# EAGLE design 8-Bit Instruction Register Part 2 (EAGLE 7.5.0)
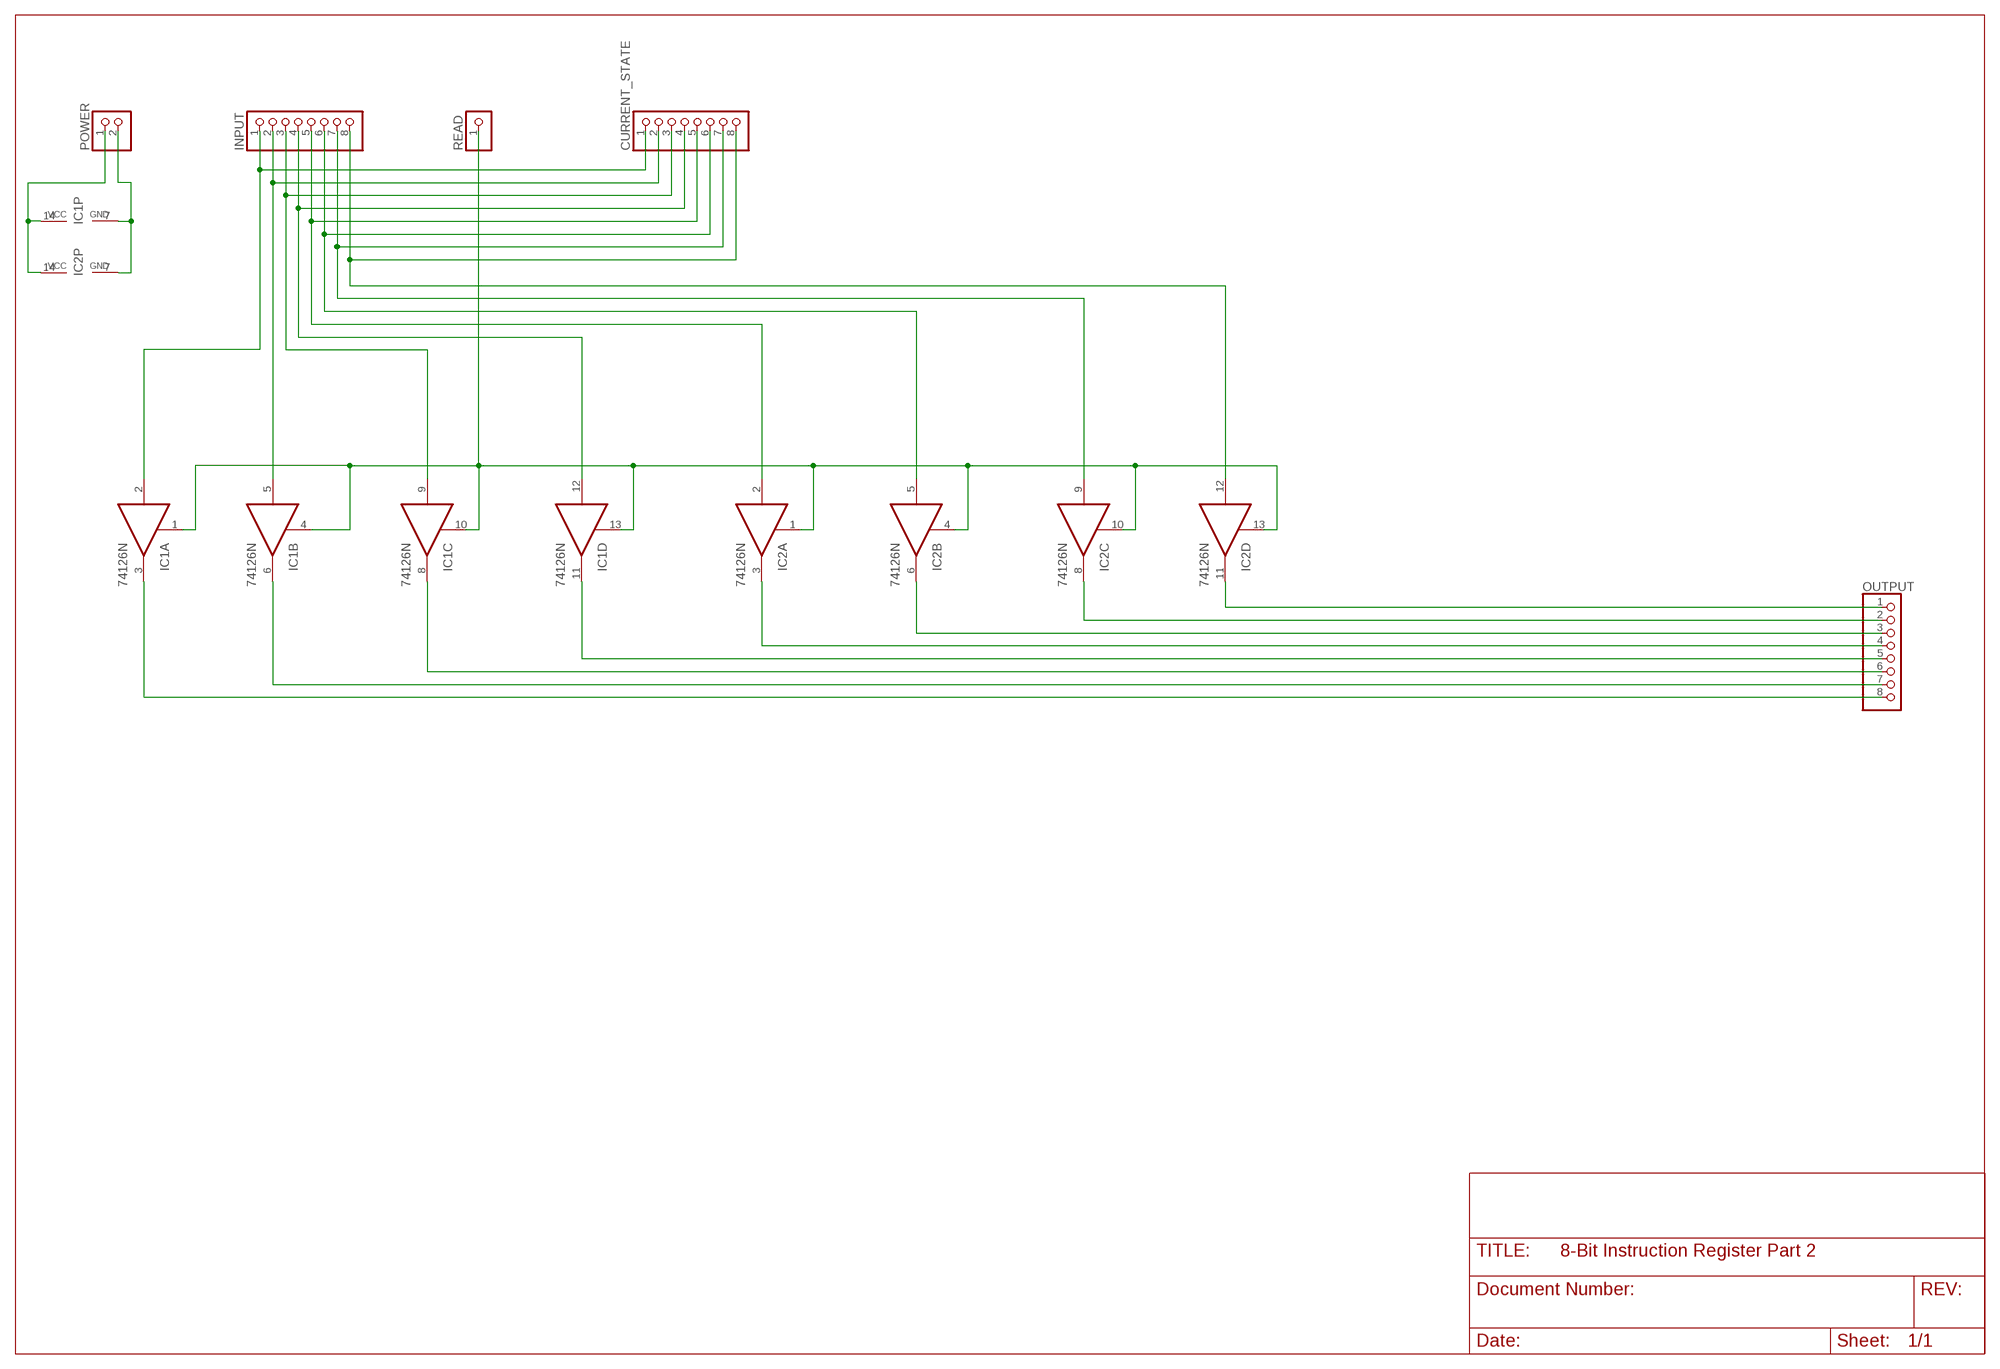
[diagram p0: schematic, sheet 1]

## Parts
CURRENT_STATE  PINHD-1X8  [1X08]
IC1  74126N  [DIL14]
IC2  74126N  [DIL14]
INPUT  PINHD-1X8  [1X08]
OUTPUT  PINHD-1X8  [1X08]
POWER  PINHD-1X2  [1X02]
READ  PINHD-1X1  [1X01]

## Nets
GND: IC1.7(P:GND) IC2.7(P:GND) POWER.2
N$1: CURRENT_STATE.1 IC1.2(A:I) INPUT.1
N$2: CURRENT_STATE.2 IC1.5(B:I) INPUT.2
N$3: CURRENT_STATE.3 IC1.9(C:I) INPUT.3
N$4: CURRENT_STATE.4 IC1.12(D:I) INPUT.4
N$5: CURRENT_STATE.5 IC2.2(A:I) INPUT.5
N$6: CURRENT_STATE.6 IC2.5(B:I) INPUT.6
N$7: CURRENT_STATE.7 IC2.9(C:I) INPUT.7
N$8: CURRENT_STATE.8 IC2.12(D:I) INPUT.8
N$10: IC1.1(A:OE) IC1.4(B:OE) IC1.10(C:OE) IC1.13(D:OE) IC2.1(A:OE) IC2.4(B:OE) IC2.10(C:OE) IC2.13(D:OE) READ.1
N$11: IC1.3(A:O) OUTPUT.8
N$12: IC1.6(B:O) OUTPUT.7
N$13: IC1.8(C:O) OUTPUT.6
N$14: IC1.11(D:O) OUTPUT.5
N$15: IC2.3(A:O) OUTPUT.4
N$16: IC2.6(B:O) OUTPUT.3
N$17: IC2.8(C:O) OUTPUT.2
N$18: IC2.11(D:O) OUTPUT.1
VCC: IC1.14(P:VCC) IC2.14(P:VCC) POWER.1

## Library data of the parts
CURRENT_STATE INPUT OUTPUT = pinhead:PINHD-1X8: PIN HEADER
IC1 IC2 = 74xx-eu:74*126: Quad bus BUFFER, 3-state
POWER = pinhead:PINHD-1X2: PIN HEADER
READ = pinhead:PINHD-1X1: PIN HEADER

## Board
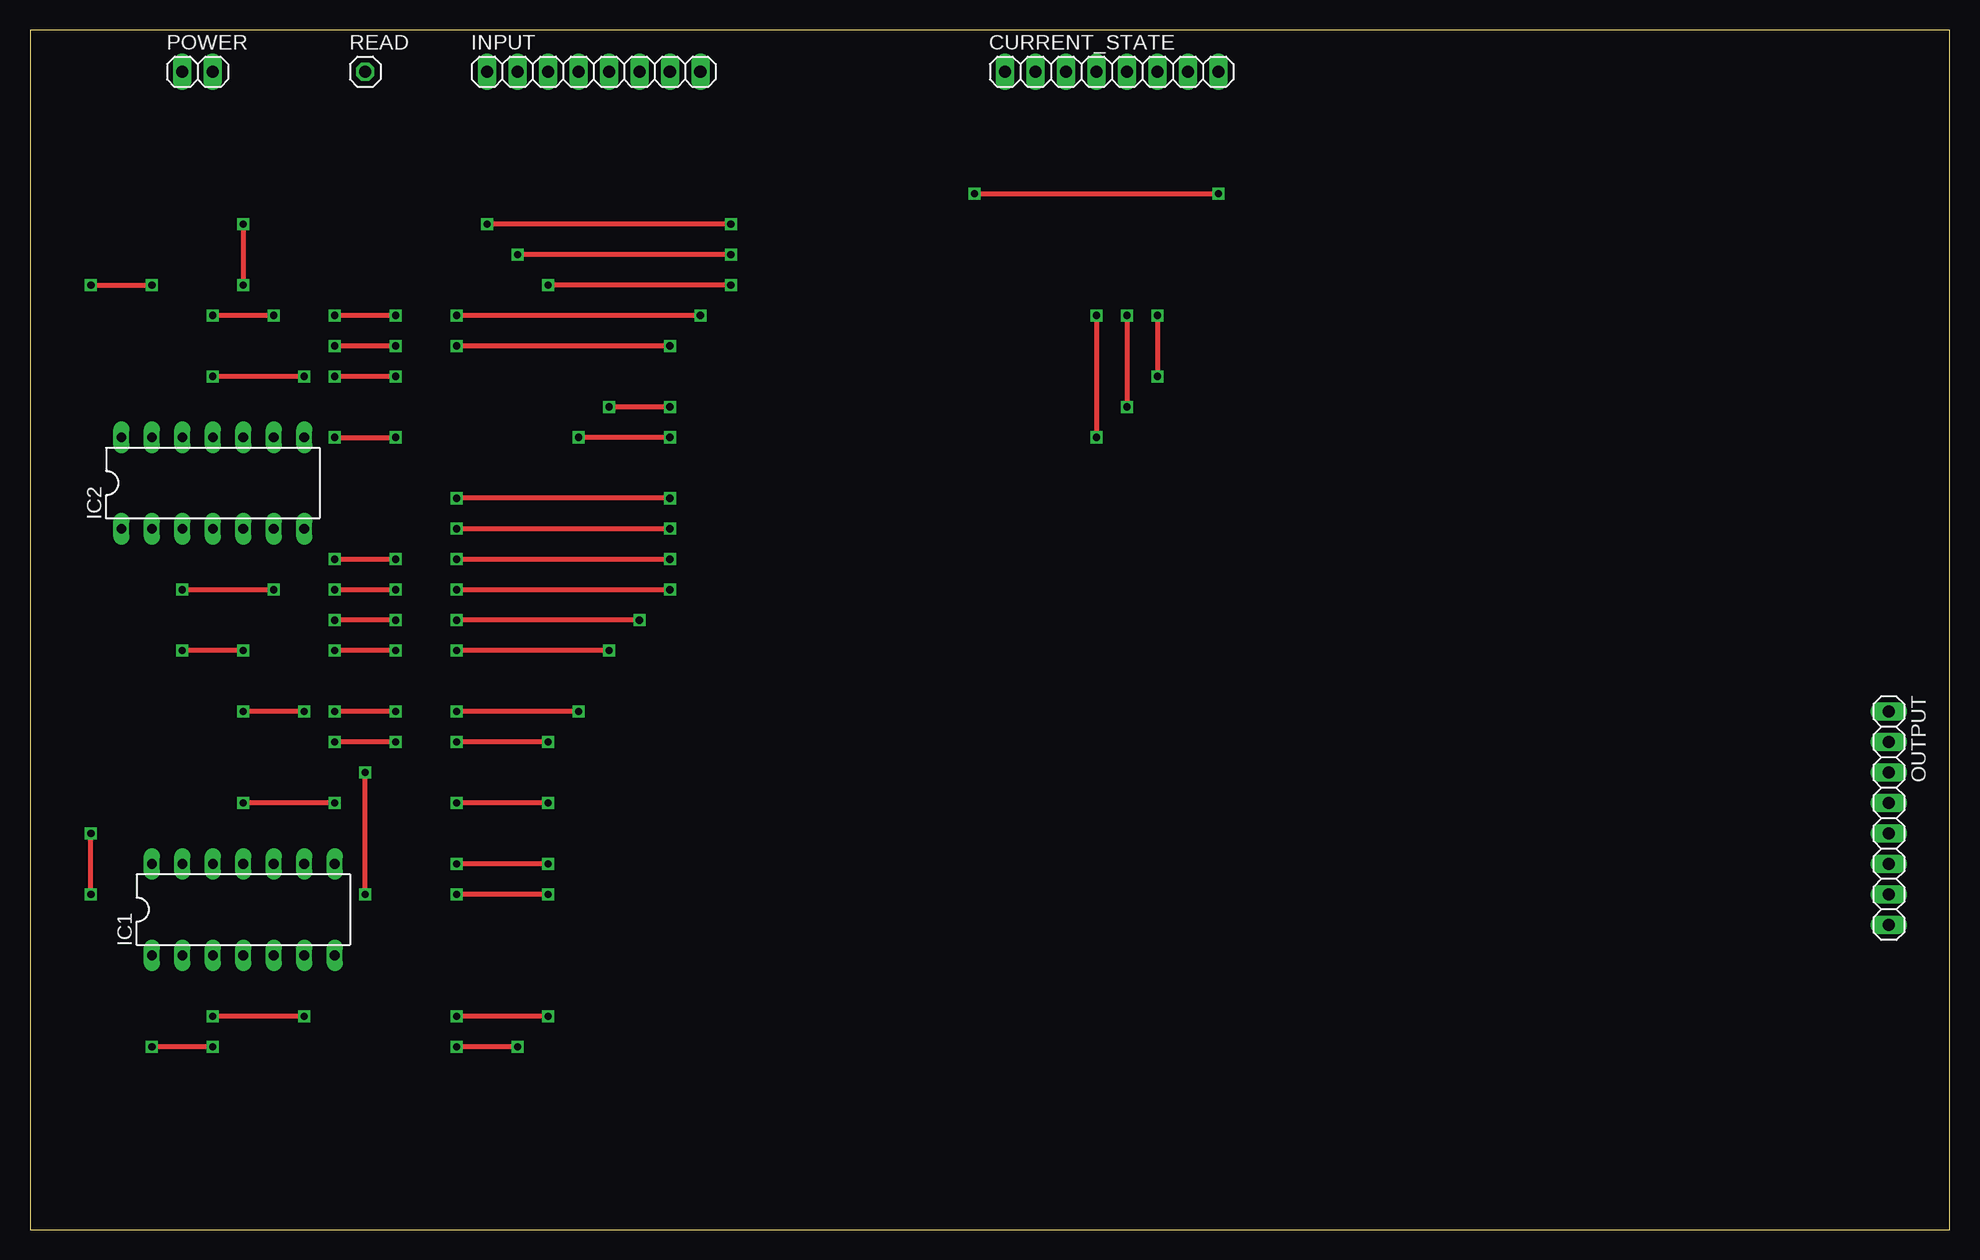
[diagram p1: board, top side]
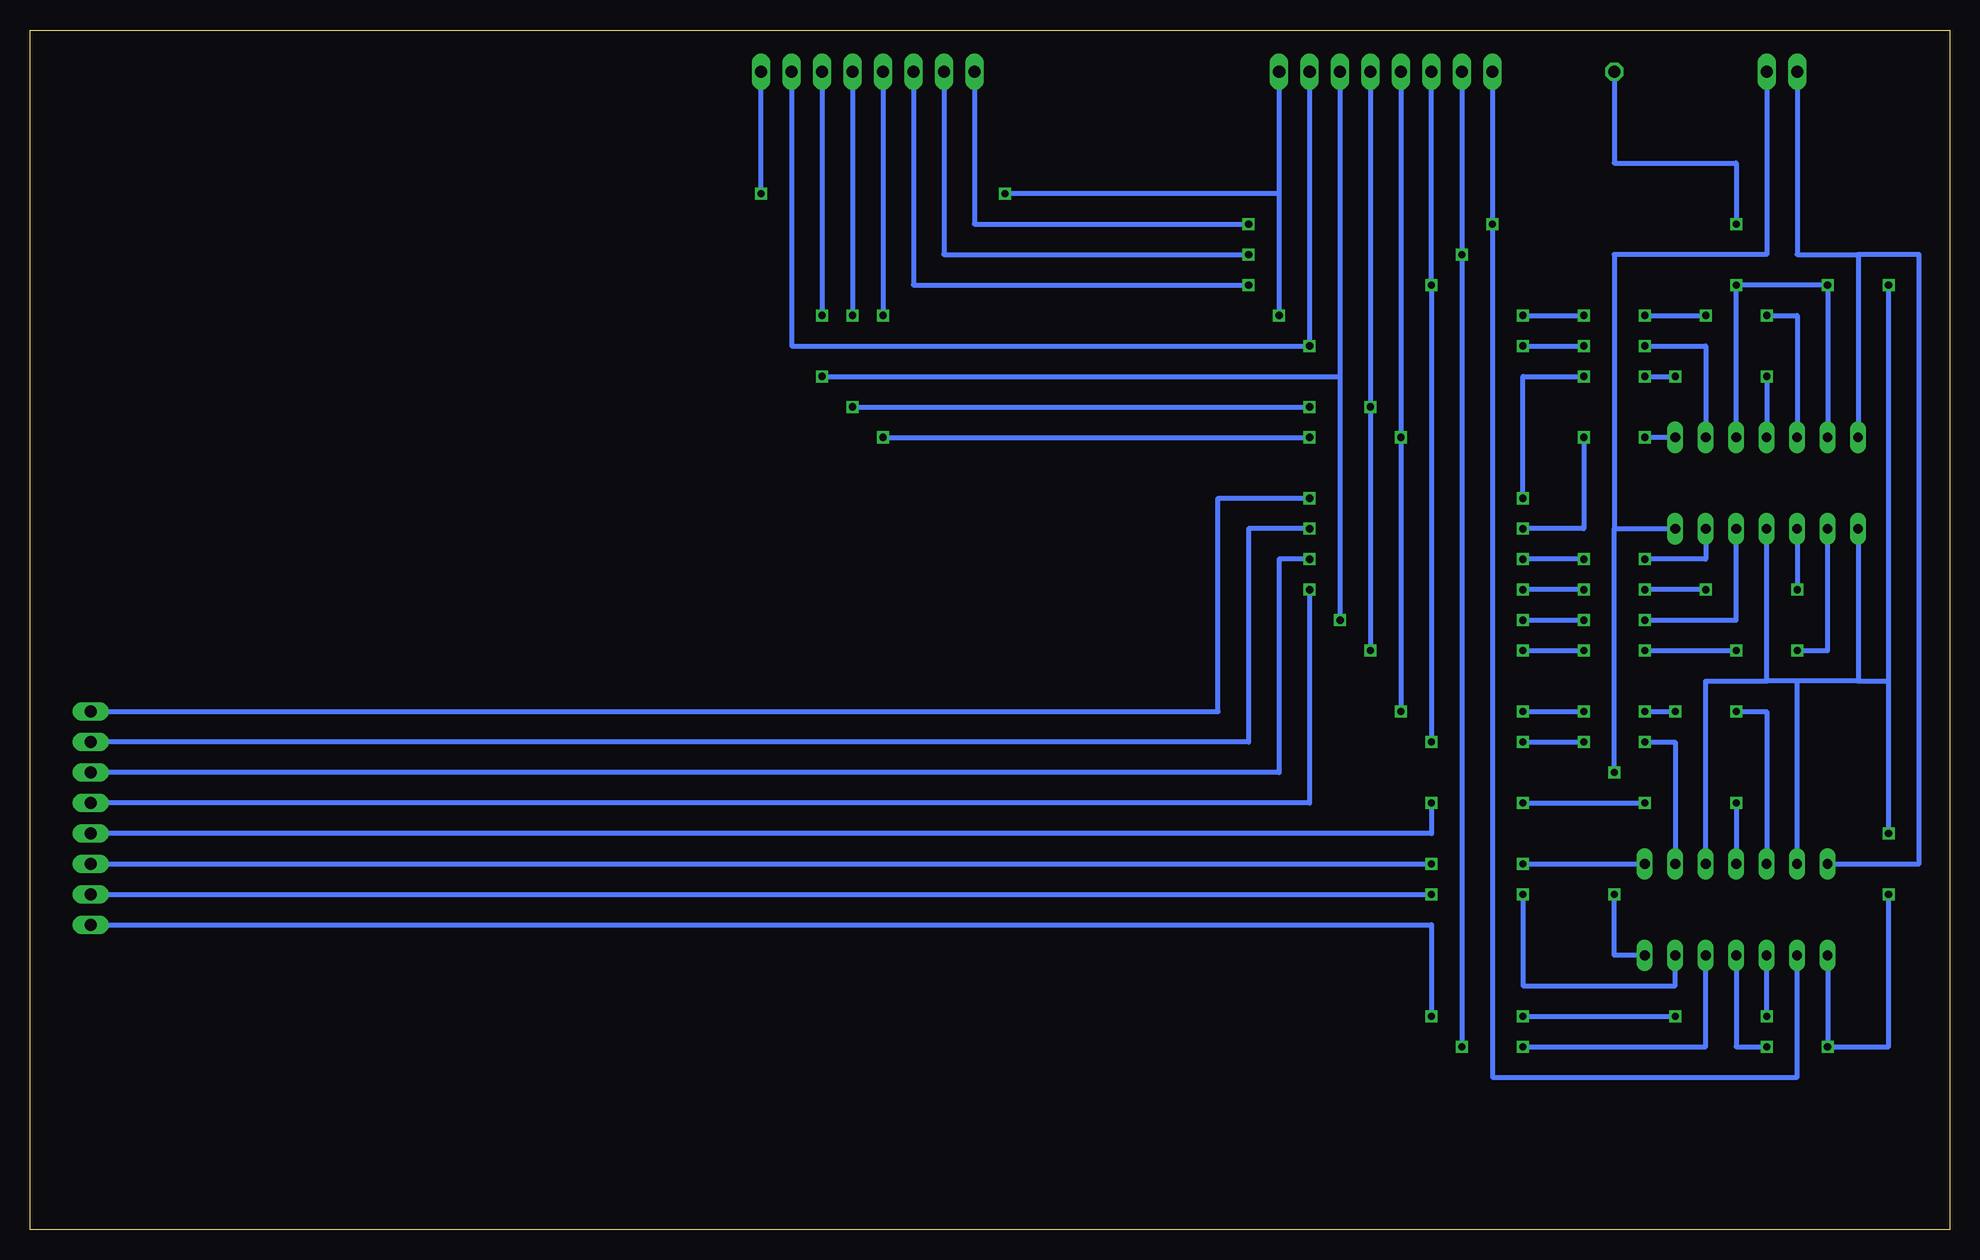
[diagram p2: board, bottom side, seen from below]

Size 160 x 100 mm. Coordinates in mm from the lower left corner, seen from the top.
Outline: 0,0 160,0 160,100 0,100 0,0
Copper layers (1*16): Top 0.035mm / dielectric 1.5mm / Bottom 0.035mm
Design rules "default": minimum track width 10mil, minimum drill 24mil, track to track 8mil, track to pad 8mil, pad to pad 8mil, via to via 8mil, smd to smd 8mil, copper to edge 40mil, drill to drill 8mil, minimum pad ring 10mil, minimum via ring 8mil, stop-mask expansion 4mil, vias tented up to drill 0mil, thermal gap 10mil

### Footprints (pad centres in the part's own frame; a part is rotated, then mirrored left to right if it is on the bottom)
1X08 = drill 1.016 long: 1 -8.89,0; 2 -6.35,0; 3 -3.81,0; 4 -1.27,0; 5 1.27,0; 6 3.81,0; 7 6.35,0; 8 8.89,0
DIL14 = drill 0.813 long: 1 -7.62,-3.81; 2 -5.08,-3.81; 3 -2.54,-3.81; 4 0,-3.81; 5 2.54,-3.81; 6 5.08,-3.81; 7 7.62,-3.81; 8 7.62,3.81; 9 5.08,3.81; 10 2.54,3.81; 11 0,3.81; 12 -2.54,3.81; 13 -5.08,3.81; 14 -7.62,3.81
1X02 = drill 1.016 long: 1 -1.27,0; 2 1.27,0
1X01 = drill 1.016 octagon: 1 0,0

### Placement (x,y rotation side)
CURRENT_STATE  90.17,96.52 0 top
IC1  17.78,26.67 0 top
IC2  15.24,62.23 0 top
INPUT  46.99,96.52 0 top
OUTPUT  154.94,34.29 270 top
POWER  13.97,96.52 0 top
READ  27.94,96.52 0 top

### Tracks (layer width: path | path; a pad name or v marks a point on that pad's centre or on a via)
GND  (via drill 0.6)
  Top 0.406: v27.94,27.94 v27.94,38.1
  Bottom 0.406: POWER.2 15.24,81.28 27.94,81.28 27.94,58.42 | 27.94,58.42 IC2.7 | IC1.7 27.94,22.86 v27.94,27.94 | v27.94,38.1 27.94,58.42
N$1  (via drill 0.6)
  Top 0.406: v58.42,83.82 v38.1,83.82
  Bottom 0.406: INPUT.1 v38.1,83.82 38.1,12.7 12.7,12.7 IC1.2 | CURRENT_STATE.1 81.28,83.82 v58.42,83.82
N$2  (via drill 0.6)
  Top 0.406: v40.64,15.24 v35.56,15.24 | v58.42,81.28 v40.64,81.28
  Bottom 0.406: INPUT.2 v40.64,81.28 v40.64,15.24 | v35.56,15.24 20.32,15.24 IC1.5 | CURRENT_STATE.2 83.82,81.28 v58.42,81.28
N$3  (via drill 0.6)
  Top 0.406: v43.18,40.64 v35.56,40.64 | v30.48,40.64 v25.4,40.64 | v58.42,78.74 v43.18,78.74
  Bottom 0.406: v43.18,40.64 v43.18,78.74 INPUT.3 | v35.56,40.64 v30.48,40.64 | v25.4,40.64 22.86,40.64 IC1.9 | CURRENT_STATE.3 86.36,78.74 v58.42,78.74
N$4  (via drill 0.6)
  Top 0.406: v45.72,43.18 v35.56,43.18 | v30.48,43.18 v25.4,43.18 | v22.86,43.18 v17.78,43.18 | v88.9,76.2 v88.9,66.04 | v53.34,66.04 v45.72,66.04
  Bottom 0.406: INPUT.4 v45.72,66.04 v45.72,43.18 | v35.56,43.18 v30.48,43.18 | v25.4,43.18 v22.86,43.18 | v17.78,43.18 15.24,43.18 IC1.12 | CURRENT_STATE.4 v88.9,76.2 | v88.9,66.04 v53.34,66.04
N$5  (via drill 0.6)
  Top 0.406: v48.26,48.26 v35.56,48.26 | v30.48,48.26 v25.4,48.26 | v17.78,48.26 v12.7,48.26 | v91.44,76.2 v91.44,68.58 | v53.34,68.58 v48.26,68.58
  Bottom 0.406: INPUT.5 v48.26,68.58 v48.26,48.26 | v35.56,48.26 v30.48,48.26 | v25.4,48.26 v17.78,48.26 | v12.7,48.26 10.16,48.26 IC2.2 | CURRENT_STATE.5 v91.44,76.2 | v91.44,68.58 v53.34,68.58
N$6  (via drill 0.6)
  Top 0.406: v50.8,50.8 v35.56,50.8 | v30.48,50.8 v25.4,50.8 | v93.98,76.2 v93.98,71.12
  Bottom 0.406: INPUT.6 50.8,71.12 | 50.8,71.12 v50.8,50.8 | v35.56,50.8 v30.48,50.8 | v25.4,50.8 17.78,50.8 IC2.5 | CURRENT_STATE.6 v93.98,76.2 | v93.98,71.12 50.8,71.12
N$7  (via drill 0.6)
  Top 0.406: v53.34,73.66 v35.56,73.66 | v30.48,73.66 v25.4,73.66
  Bottom 0.406: INPUT.7 v53.34,73.66 96.52,73.66 CURRENT_STATE.7 | v35.56,73.66 v30.48,73.66 | v25.4,73.66 20.32,73.66 IC2.9
N$8  (via drill 0.6)
  Top 0.406: v55.88,76.2 v35.56,76.2 | v30.48,76.2 v25.4,76.2 | v20.32,76.2 v15.24,76.2 | v78.74,86.36 v99.06,86.36
  Bottom 0.406: 55.88,86.36 v55.88,76.2 | v35.56,76.2 v30.48,76.2 | v25.4,76.2 v20.32,76.2 | v15.24,76.2 12.7,76.2 IC2.12 | INPUT.8 55.88,86.36 | 55.88,86.36 v78.74,86.36 | v99.06,86.36 CURRENT_STATE.8
N$10  (via drill 0.6)
  Top 0.406: v17.78,83.82 v17.78,78.74 | v5.08,78.74 v10.16,78.74 | v5.08,27.94 v5.08,33.02 | v15.24,15.24 v10.16,15.24
  Bottom 0.406: v17.78,83.82 17.78,88.9 27.94,88.9 READ.1 | IC2.13 v10.16,78.74 v17.78,78.74 IC2.10 | IC2.1 7.62,45.72 | 7.62,45.72 5.08,45.72 | 5.08,45.72 v5.08,78.74 | 7.62,45.72 12.7,45.72 | 12.7,45.72 15.24,45.72 | 15.24,45.72 IC2.4 | IC1.13 12.7,45.72 | IC1.10 20.32,45.72 15.24,45.72 | IC1.1 v10.16,15.24 5.08,15.24 v5.08,27.94 | v5.08,33.02 5.08,45.72 | IC1.4 17.78,15.24 v15.24,15.24
N$11  (via drill 0.6)
  Top 0.406: v43.18,17.78 v35.56,17.78 | v22.86,17.78 v15.24,17.78
  Bottom 0.406: OUTPUT.8 43.18,25.4 v43.18,17.78 | v35.56,17.78 v22.86,17.78 | v15.24,17.78 IC1.3
N$12  (via drill 0.6)
  Top 0.406: v43.18,27.94 v35.56,27.94
  Bottom 0.406: OUTPUT.7 v43.18,27.94 | v35.56,27.94 35.56,20.32 22.86,20.32 IC1.6
N$13  (via drill 0.6)
  Top 0.406: v43.18,30.48 v35.56,30.48
  Bottom 0.406: OUTPUT.6 v43.18,30.48 | v35.56,30.48 IC1.8
N$14  (via drill 0.6)
  Top 0.406: v25.4,35.56 v17.78,35.56 | v43.18,35.56 v35.56,35.56
  Bottom 0.406: v35.56,35.56 v25.4,35.56 | v17.78,35.56 IC1.11 | v43.18,35.56 43.18,33.02 OUTPUT.5
N$15  (via drill 0.6)
  Top 0.406: v12.7,53.34 v20.32,53.34 | v25.4,53.34 v30.48,53.34 | v35.56,53.34 v53.34,53.34
  Bottom 0.406: IC2.3 v12.7,53.34 | v20.32,53.34 v25.4,53.34 | v30.48,53.34 v35.56,53.34 | v53.34,53.34 53.34,35.56 OUTPUT.4
N$16  (via drill 0.6)
  Top 0.406: v25.4,55.88 v30.48,55.88 | v35.56,55.88 v53.34,55.88
  Bottom 0.406: IC2.6 20.32,55.88 v25.4,55.88 | v30.48,55.88 v35.56,55.88 | v53.34,55.88 55.88,55.88 55.88,38.1 OUTPUT.3
N$17  (via drill 0.6)
  Top 0.406: v25.4,66.04 v30.48,66.04 | v35.56,58.42 v53.34,58.42
  Bottom 0.406: IC2.8 v25.4,66.04 | v30.48,66.04 30.48,58.42 v35.56,58.42 | v53.34,58.42 58.42,58.42 58.42,40.64 OUTPUT.2
N$18  (via drill 0.6)
  Top 0.406: v53.34,60.96 v35.56,60.96 | v30.48,71.12 v25.4,71.12 | v22.86,71.12 v15.24,71.12
  Bottom 0.406: OUTPUT.1 60.96,43.18 60.96,60.96 v53.34,60.96 | v35.56,60.96 35.56,71.12 v30.48,71.12 | v25.4,71.12 v22.86,71.12 | v15.24,71.12 IC2.11
VCC
  Bottom 0.406: POWER.1 12.7,81.28 7.62,81.28 | 7.62,81.28 IC2.14 | IC1.14 2.54,30.48 2.54,81.28 7.62,81.28